# Altium schematic sheet Camera 11-12.SchDoc
size A; DrawnBy: Nick D'Ademo; DocumentNumber: 7; Revision: A; SheetNumber: 7; SheetTotal: 11
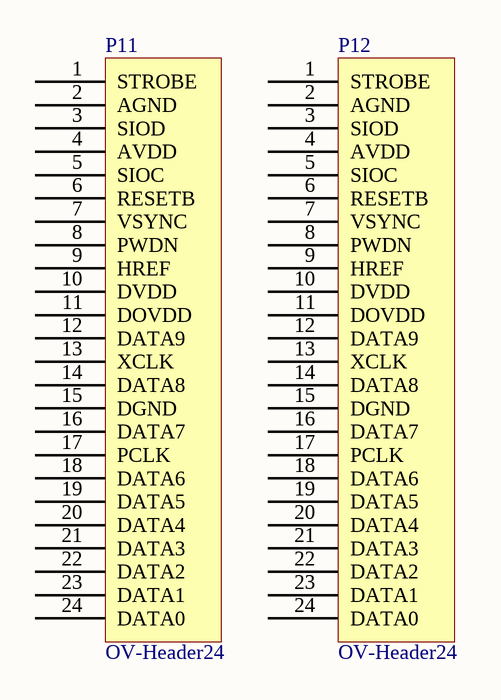
[diagram p0: Camera 11-12.SchDoc]

## Parts
P11  OV-Header24  [2-1734592-4_REVERSED]
P12  OV-Header24  [2-1734592-4_REVERSED]

## Nets

Not connected (* = marked no-connect by the designer): P11 1(STROBE) 2(AGND) 3(SIOD) 4(AVDD) 5(SIOC) 6(RESETB) 7(VSYNC) 8(PWDN) 9(HREF) 10(DVDD) 11(DOVDD) 12(DATA9) 13(XCLK) 14(DATA8) 15(DGND) 16(DATA7) 17(PCLK) 18(DATA6) 19(DATA5) 20(DATA4) 21(DATA3) 22(DATA2) 23(DATA1) 24(DATA0); P12 1(STROBE) 2(AGND) 3(SIOD) 4(AVDD) 5(SIOC) 6(RESETB) 7(VSYNC) 8(PWDN) 9(HREF) 10(DVDD) 11(DOVDD) 12(DATA9) 13(XCLK) 14(DATA8) 15(DGND) 16(DATA7) 17(PCLK) 18(DATA6) 19(DATA5) 20(DATA4) 21(DATA3) 22(DATA2) 23(DATA1) 24(DATA0)

## Library data of the parts
P11 P12 = OV-Header24: TE CONNECTIVITY - 2-1734592-4 - CONN FPC BOTTOM 24POS 0.50MM R/A